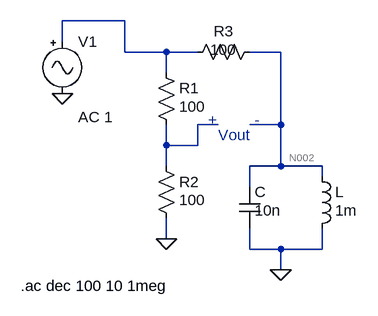
[diagram p0: schematic Draft1.asc]
Draft1.asc, the LTspice schematic file:
Version 4
SHEET 1 880 680
WIRE 208 96 112 96
WIRE 112 128 112 96
WIRE 208 144 208 96
WIRE 272 144 208 144
WIRE 320 144 272 144
WIRE 448 144 400 144
WIRE 272 176 272 144
WIRE 352 256 320 256
WIRE 448 256 448 144
WIRE 448 256 400 256
WIRE 272 288 272 256
WIRE 320 288 320 256
WIRE 320 288 272 288
WIRE 272 320 272 288
WIRE 448 320 448 256
WIRE 448 320 400 320
WIRE 512 320 448 320
WIRE 512 336 512 320
WIRE 400 352 400 320
WIRE 272 432 272 400
WIRE 400 448 400 416
WIRE 448 448 400 448
WIRE 512 448 512 416
WIRE 512 448 448 448
WIRE 448 480 448 448
FLAG 448 480 0
FLAG 272 432 0
FLAG 112 208 0
SYMBOL cap 384 352 R0
WINDOW 3 24 36 Left 2
SYMATTR Value 10n
SYMATTR InstName C
SYMBOL ind 496 320 R0
WINDOW 3 36 68 Left 2
SYMATTR Value 1m
SYMATTR InstName L
SYMBOL res 256 160 R0
WINDOW 3 36 68 Left 2
SYMATTR Value 100
SYMATTR InstName R1
SYMBOL res 256 304 R0
WINDOW 3 36 68 Left 2
SYMATTR Value 100
SYMATTR InstName R2
SYMBOL res 416 128 R90
WINDOW 0 0 56 VBottom 2
WINDOW 3 28 56 VBottom 2
SYMATTR InstName R3
SYMATTR Value 100
SYMBOL Misc\\signal 112 112 R0
WINDOW 123 24 132 Left 2
WINDOW 39 0 0 Left 2
SYMATTR InstName V1
SYMATTR Value ""
SYMATTR Value2 AC 1
TEXT 336 248 Left 2 ;+
TEXT 408 248 Left 2 ;-
TEXT 352 272 Left 2 ;Vout
TEXT 48 504 Left 2 !.ac dec 100 10 1meg

The netlist it stands for:
* Draft1.asc
C N002 0 10n
L N002 0 1m
R1 N001 N003 100
R2 N003 0 100
R3 N002 N001 100
V1 N001 0 AC 1
* +
* -
* Vout
.ac dec 100 10 1meg
.backanno
.end

* Results of the author's LTspice run, read from the files saved beside the schematic
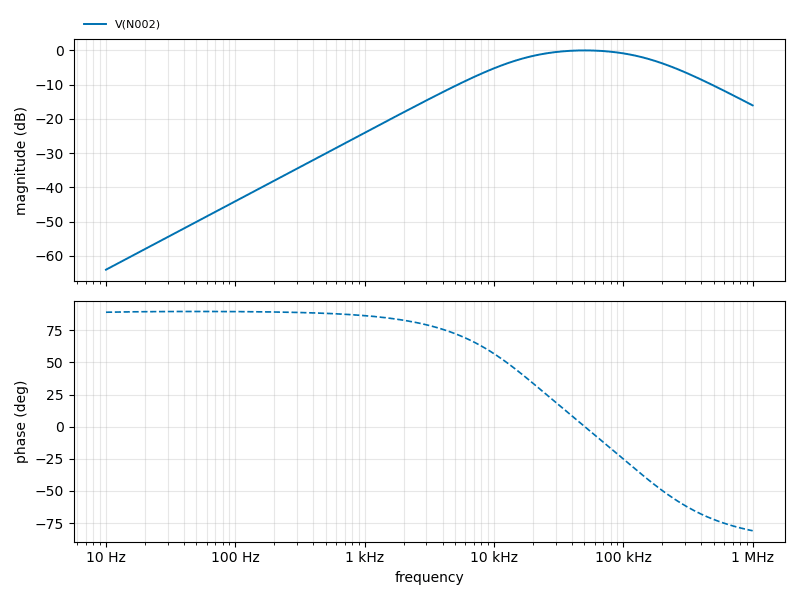
[diagram p1: AC Analysis of Draft1.asc, plotted from the saved traces]
* AC Analysis, 1 run:
*   V(N002): -64.04 dB at 10 Hz, -16.05 dB at 1 MHz, peak -0.00 dB at 50.12 kHz, 3 dB below the peak at 14.58 kHz and 173.7 kHz